# EAGLE design project_2 (EAGLE 9.6.2)
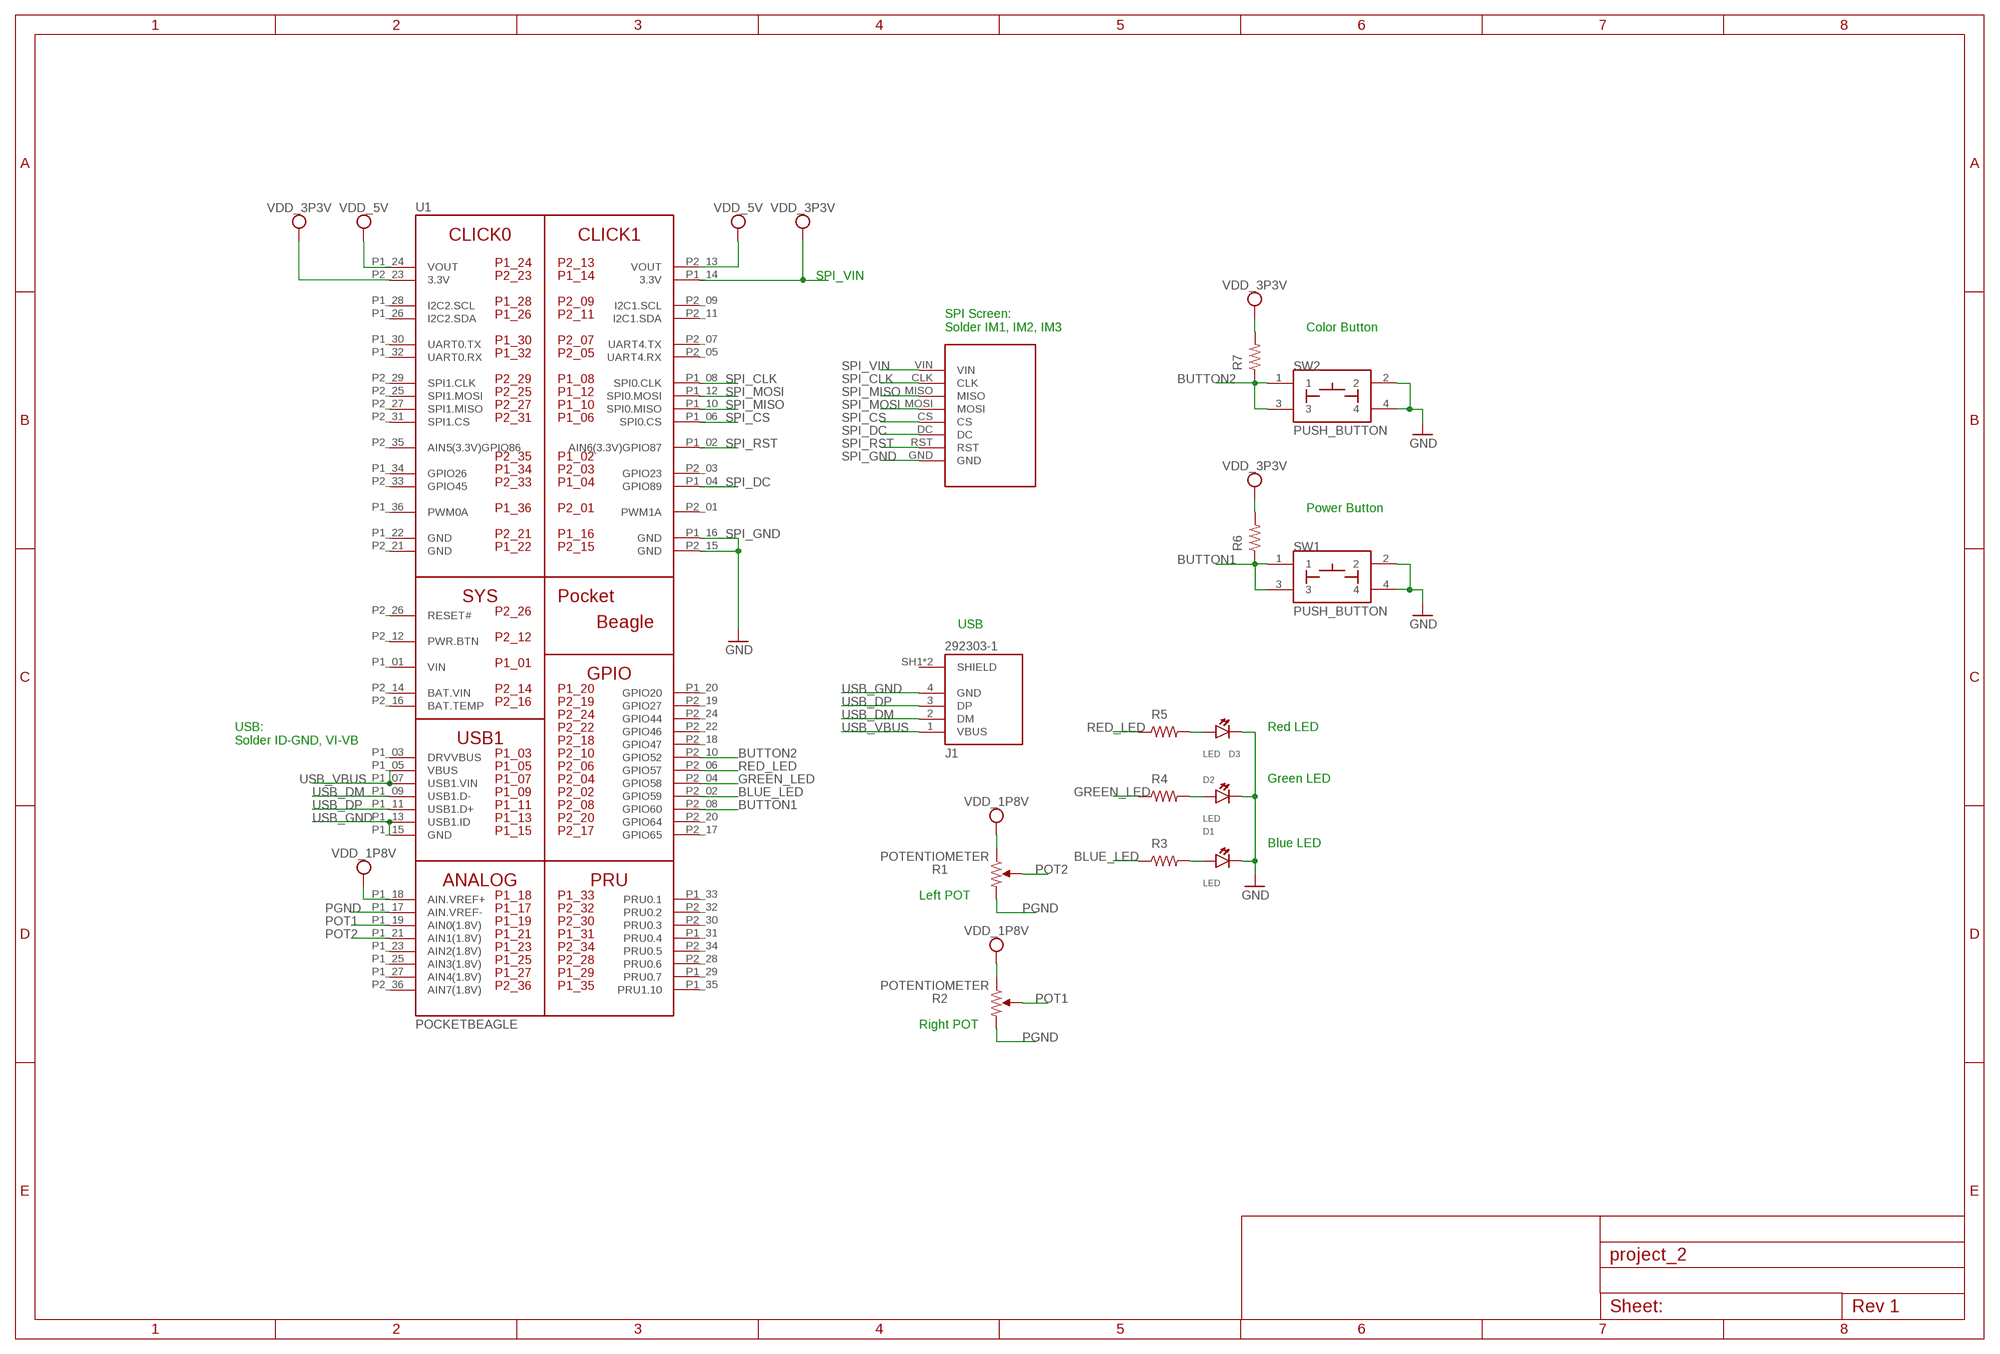
[diagram p0: schematic, sheet 1]

## Parts
D1  LED  [EIA-STD]
D2  LED  [EIA-STD]
D3  LED  [EIA-STD]
J1  292303-1  [TE_292303-1]
R1  POTENTIOMETER  [POT-PO90S]
R2  POTENTIOMETER  [POT-PO90S]
R3  R_R0805  [R0805]
R4  R_R0805  [R0805]
R5  R_R0805  [R0805]
R6  R_R0805  [R0805]
R7  R_R0805  [R0805]
SW1  PUSH_BUTTON  [BUTTON_12.5MM]
SW2  PUSH_BUTTON  [BUTTON_12.5MM]
U1  POCKETBEAGLE  [POCKETBEAGLE]
U$1  SCREEN  [SCREEN]

## Nets
BLUE_LED: R3.1 U1.P2_02(GPIO59)
BUTTON1: R6.1 SW1.1 SW1.3 U1.P2_08(GPIO60)
BUTTON2: R7.1 SW2.1 SW2.3 U1.P2_10(GPIO52)
GND: D1.CATHODE D2.CATHODE D3.CATHODE SW1.2 SW1.4 SW2.2 SW2.4
GREEN_LED: R4.1 U1.P2_04(GPIO58)
N$1: D3.ANODE R5.2
N$3: D2.ANODE R4.2
N$4: D1.ANODE R3.2
PGND: R1.CW R2.CW U1.P1_17(AIN.VREF-)
POT1: R2.S U1.P1_19(AIN0(1.8V))
POT2: R1.S U1.P1_21(AIN1(1.8V))
RED_LED: R5.1 U1.P2_06(GPIO57)
SPI_CLK: U1.P1_08(SPI0.CLK) U$1.CLK
SPI_CS: U1.P1_06(SPI0.CS) U$1.CS
SPI_DC: U1.P1_04(GPIO89) U$1.DC
SPI_GND: U1.P1_16(GND) U1.P2_15(GND) U$1.GND ; supply symbol labelled GND
SPI_MISO: U1.P1_10(SPI0.MISO) U$1.MISO
SPI_MOSI: U1.P1_12(SPI0.MOSI) U$1.MOSI
SPI_RST: U1.P1_02(AIN6(3.3V)GPIO87) U$1.RST
SPI_VIN: U$1.VIN
USB_DM: J1.2(DM) U1.P1_09(USB1.D-)
USB_DP: J1.3(DP) U1.P1_11(USB1.D+)
USB_GND: J1.4(GND) U1.P1_13(USB1.ID) U1.P1_15(GND)
USB_VBUS: J1.1(VBUS) U1.P1_05(VBUS) U1.P1_07(USB1.VIN)
VDD_1P8V: R1.CCW R2.CCW U1.P1_18(AIN.VREF+)
VDD_3P3V: R6.2 R7.2 U1.P1_14(3.3V) U1.P2_23(3.3V)
VDD_5V: U1.P1_24(VOUT) U1.P2_13(VOUT)
Unconnected: J1.SH1(SHIELD) J1.SH2(SHIELD) U1.P1_03(DRVVBUS) U1.P1_20(GPIO20) U1.P1_23(AIN2(1.8V)) U1.P1_25(AIN3(1.8V)) U1.P1_26(I2C2.SDA) U1.P1_27(AIN4(1.8V)) U1.P1_28(I2C2.SCL) U1.P1_29(PRU0.7) U1.P1_30(UART0.TX) U1.P1_31(PRU0.4) U1.P1_32(UART0.RX) U1.P1_33(PRU0.1) U1.P1_34(GPIO26) U1.P1_35(PRU1.10) U1.P1_36(PWM0A) U1.P2_01(PWM1A) U1.P2_03(GPIO23) U1.P2_05(UART4.RX) U1.P2_07(UART4.TX) U1.P2_09(I2C1.SCL) U1.P2_11(I2C1.SDA) U1.P2_12(PWR.BTN) U1.P2_16(BAT.TEMP) U1.P2_17(GPIO65) U1.P2_18(GPIO47) U1.P2_19(GPIO27) U1.P2_20(GPIO64) U1.P2_22(GPIO46) U1.P2_24(GPIO44) U1.P2_25(SPI1.MOSI) U1.P2_26(RESET#) U1.P2_27(SPI1.MISO) U1.P2_28(PRU0.6) U1.P2_29(SPI1.CLK) U1.P2_30(PRU0.3) U1.P2_31(SPI1.CS) U1.P2_32(PRU0.2) U1.P2_33(GPIO45) U1.P2_34(PRU0.5) U1.P2_35(AIN5(3.3V)GPIO86) U1.P2_36(AIN7(1.8V))

## Notes on the sheet
- SPI_VIN
- SPI Screen:
  Solder IM1, IM2, IM3
- Color Button
- Power Button
- USB
- USB:
  Solder ID-GND, VI-VB
- Red LED
- Green LED
- Blue LED
- Left POT
- Right POT

## Power pins joined to a net without a drawn wire
BAT.VIN: U1.P2_14(BAT.VIN)
GND: U1.P1_22(GND) U1.P2_21(GND)
VIN: U1.P1_01(VIN)

## Library data of the parts
D1-D3 = combo_lock:LED: EIA-STD LED, LTST-C191TBKT
J1 = combo_lock:292303-1: CONN USB RECEPT R/A TYPE A 4POS Check availability <https://pricing.snapeda.com/parts/292303-1/TE%20Connectivity/view-part?ref=eda>; AVAILABILITY: In Stock; CENTERLINE_PITCH: 2 mm[.078 in]; COMMENT: 292303-1; DESCRIPTION: Conn; Data; USB; Recept; 2.0; 4 Pos; 1 Port; Rt Angle; A Ser; Tin over Copper; EU_ROHS_COMPLIANCE: Compliant; MF: TE Connectivity; MP: 292303-1; NUMBER_OF_POSITIONS: 4; PACKAGE: None; PRICE: None; PRODUCT_TYPE: Connector; PURCHASE-URL: https://pricing.snapeda.com/search/part/292303-1/?ref=eda
R1 R2 = combo_lock:POTENTIOMETER: Potentiometer - Examples: P090S-14T20BR10K (987-1277-ND)
R3-R7 = MISC:R_: RESISTOR, American symbol
SW1 SW2 = MISC:PUSH_BUTTON
U1 = combo_lock:POCKETBEAGLE
U$1 = combo_lock:SCREEN

## Board
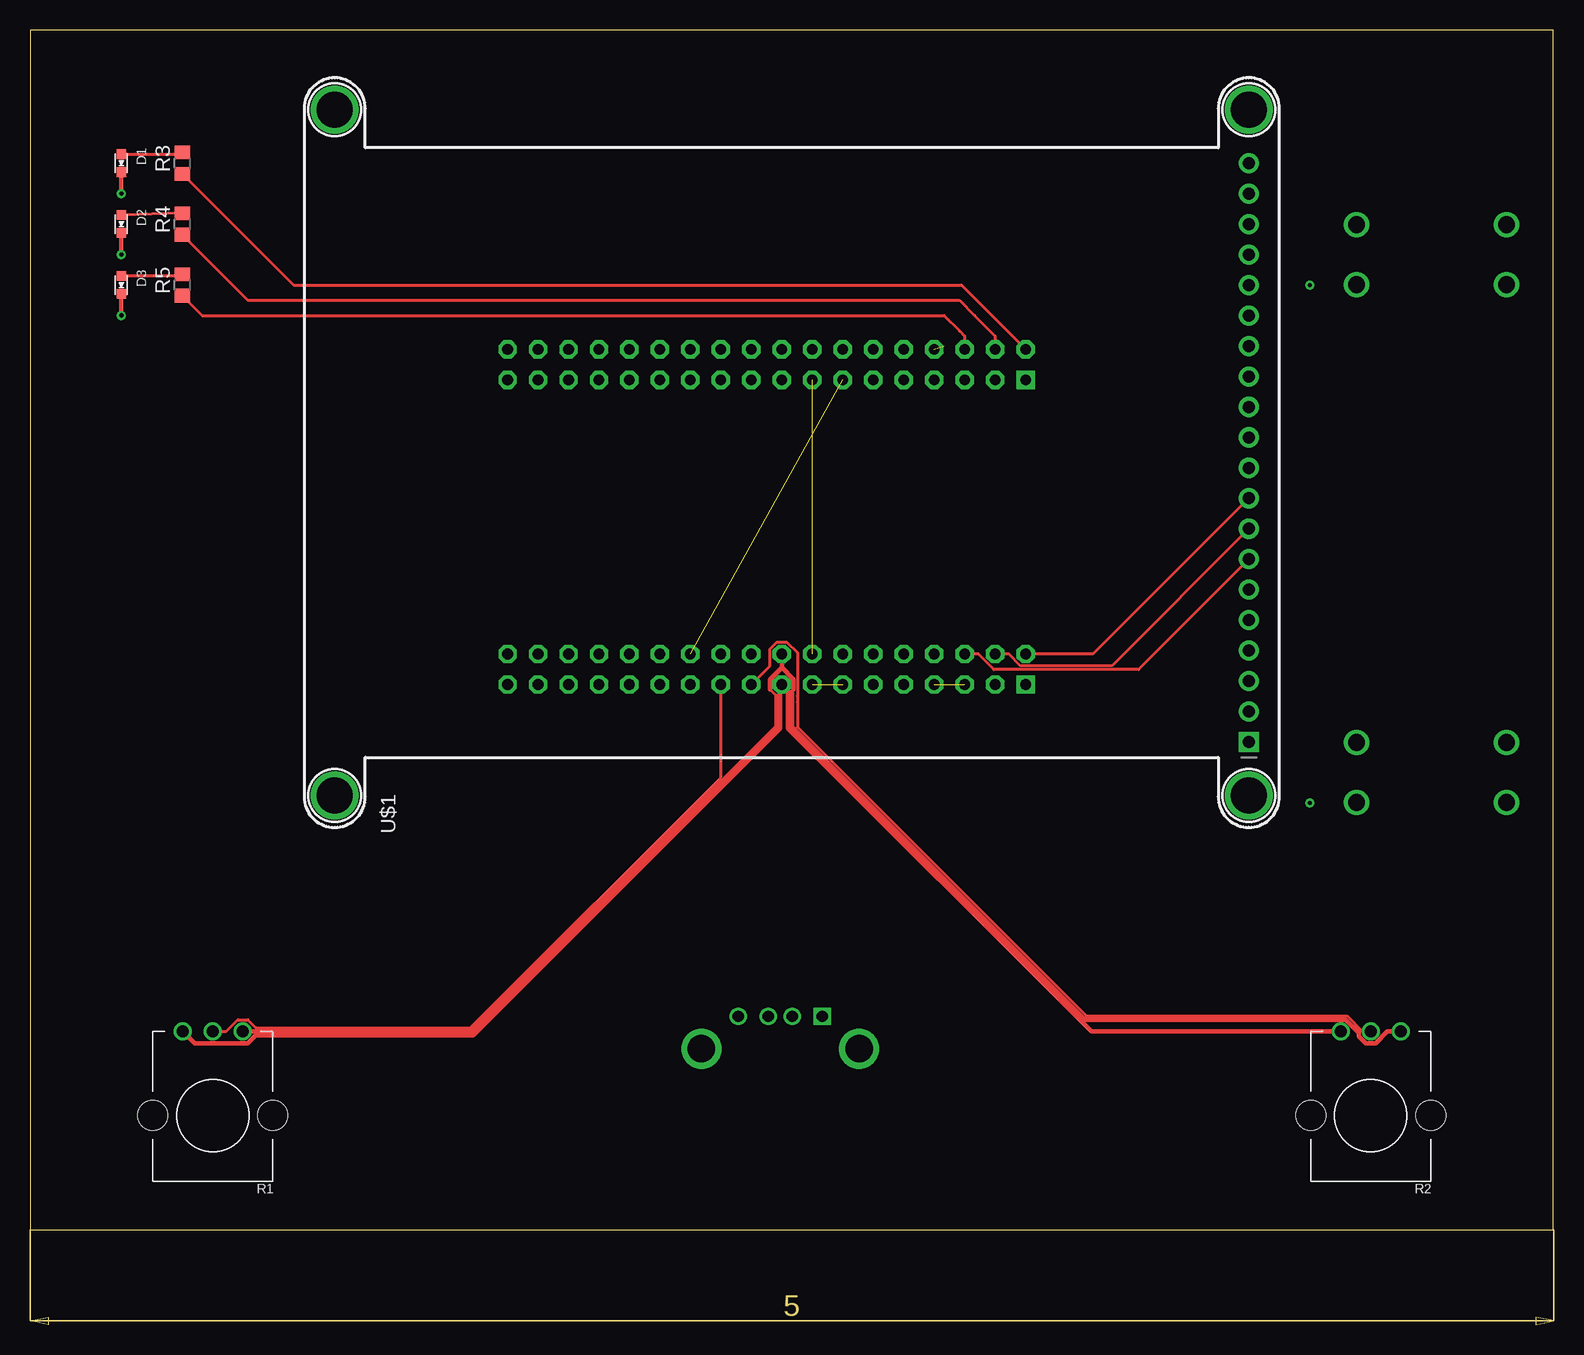
[diagram p1: board, top side]
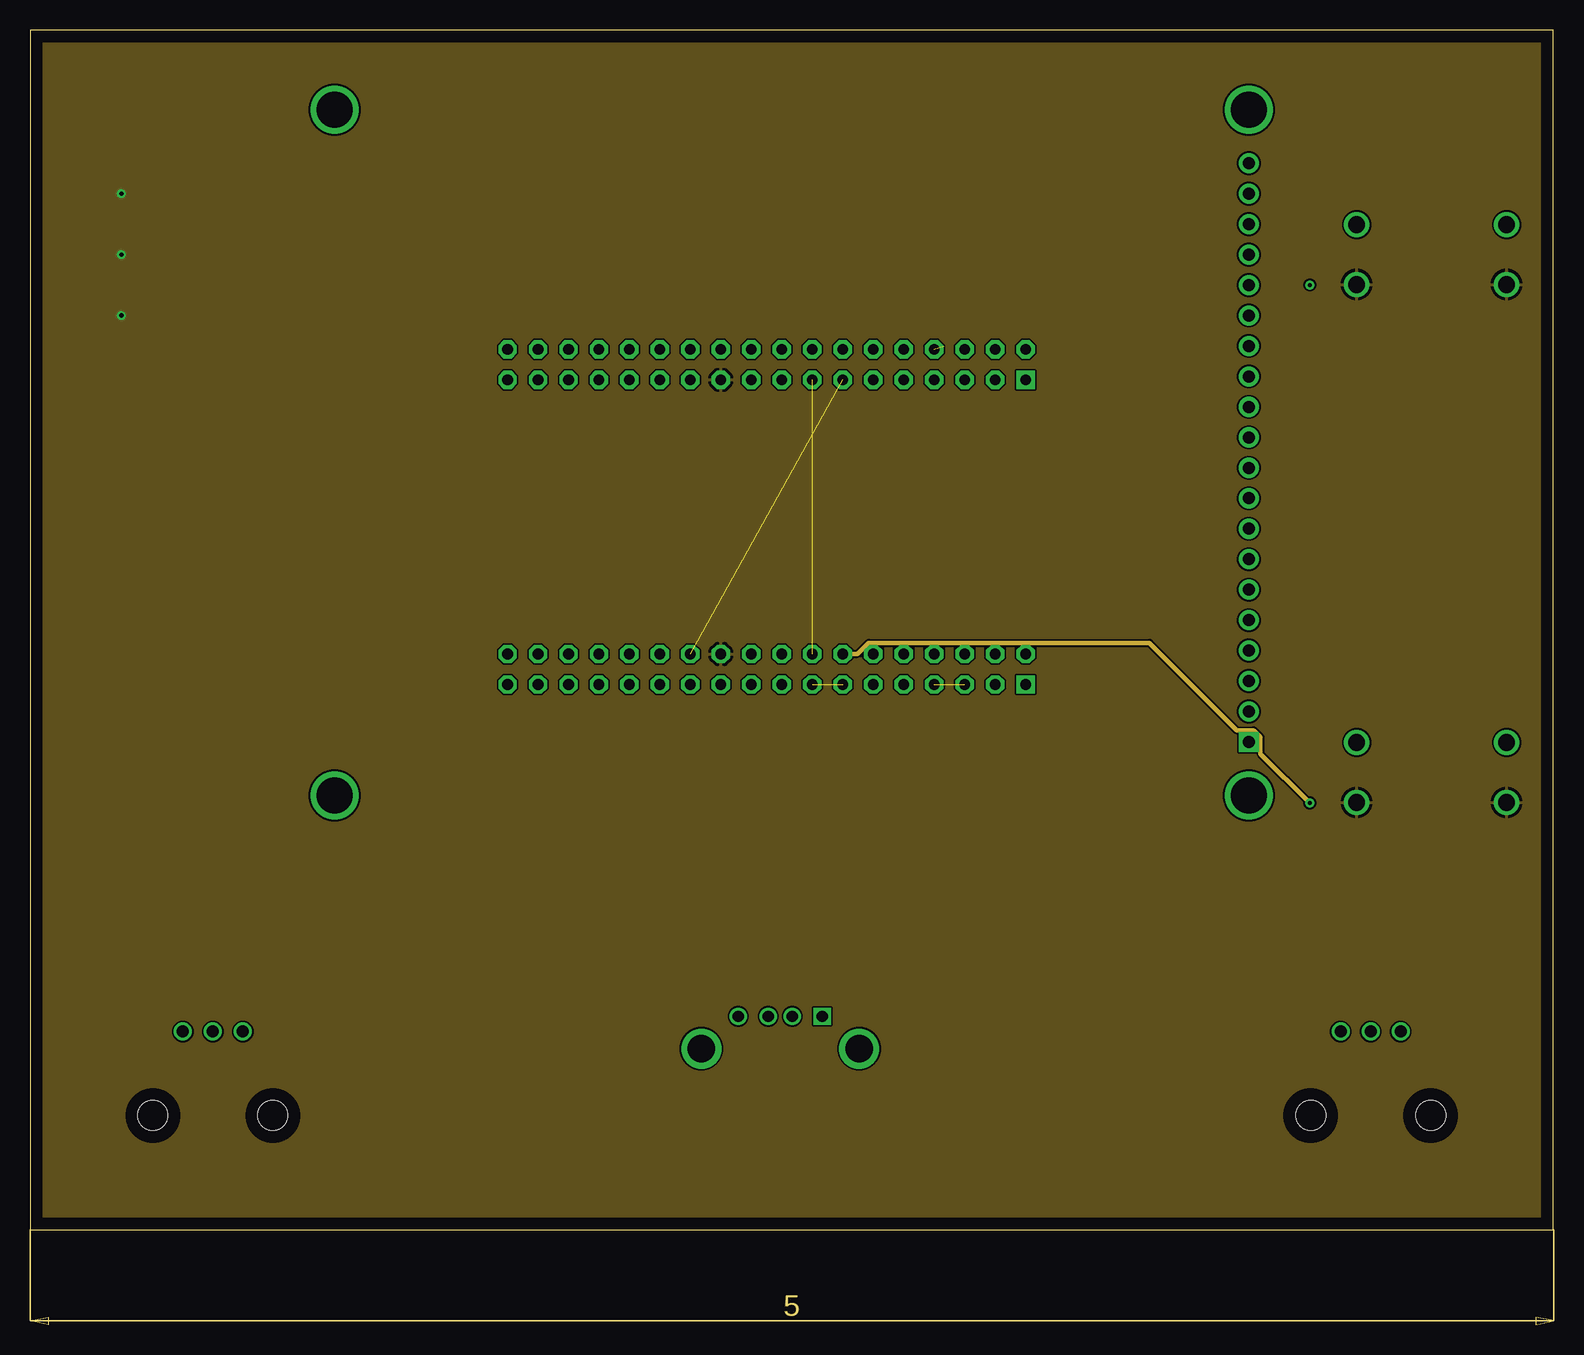
[diagram p2: board, inner layer Route2]
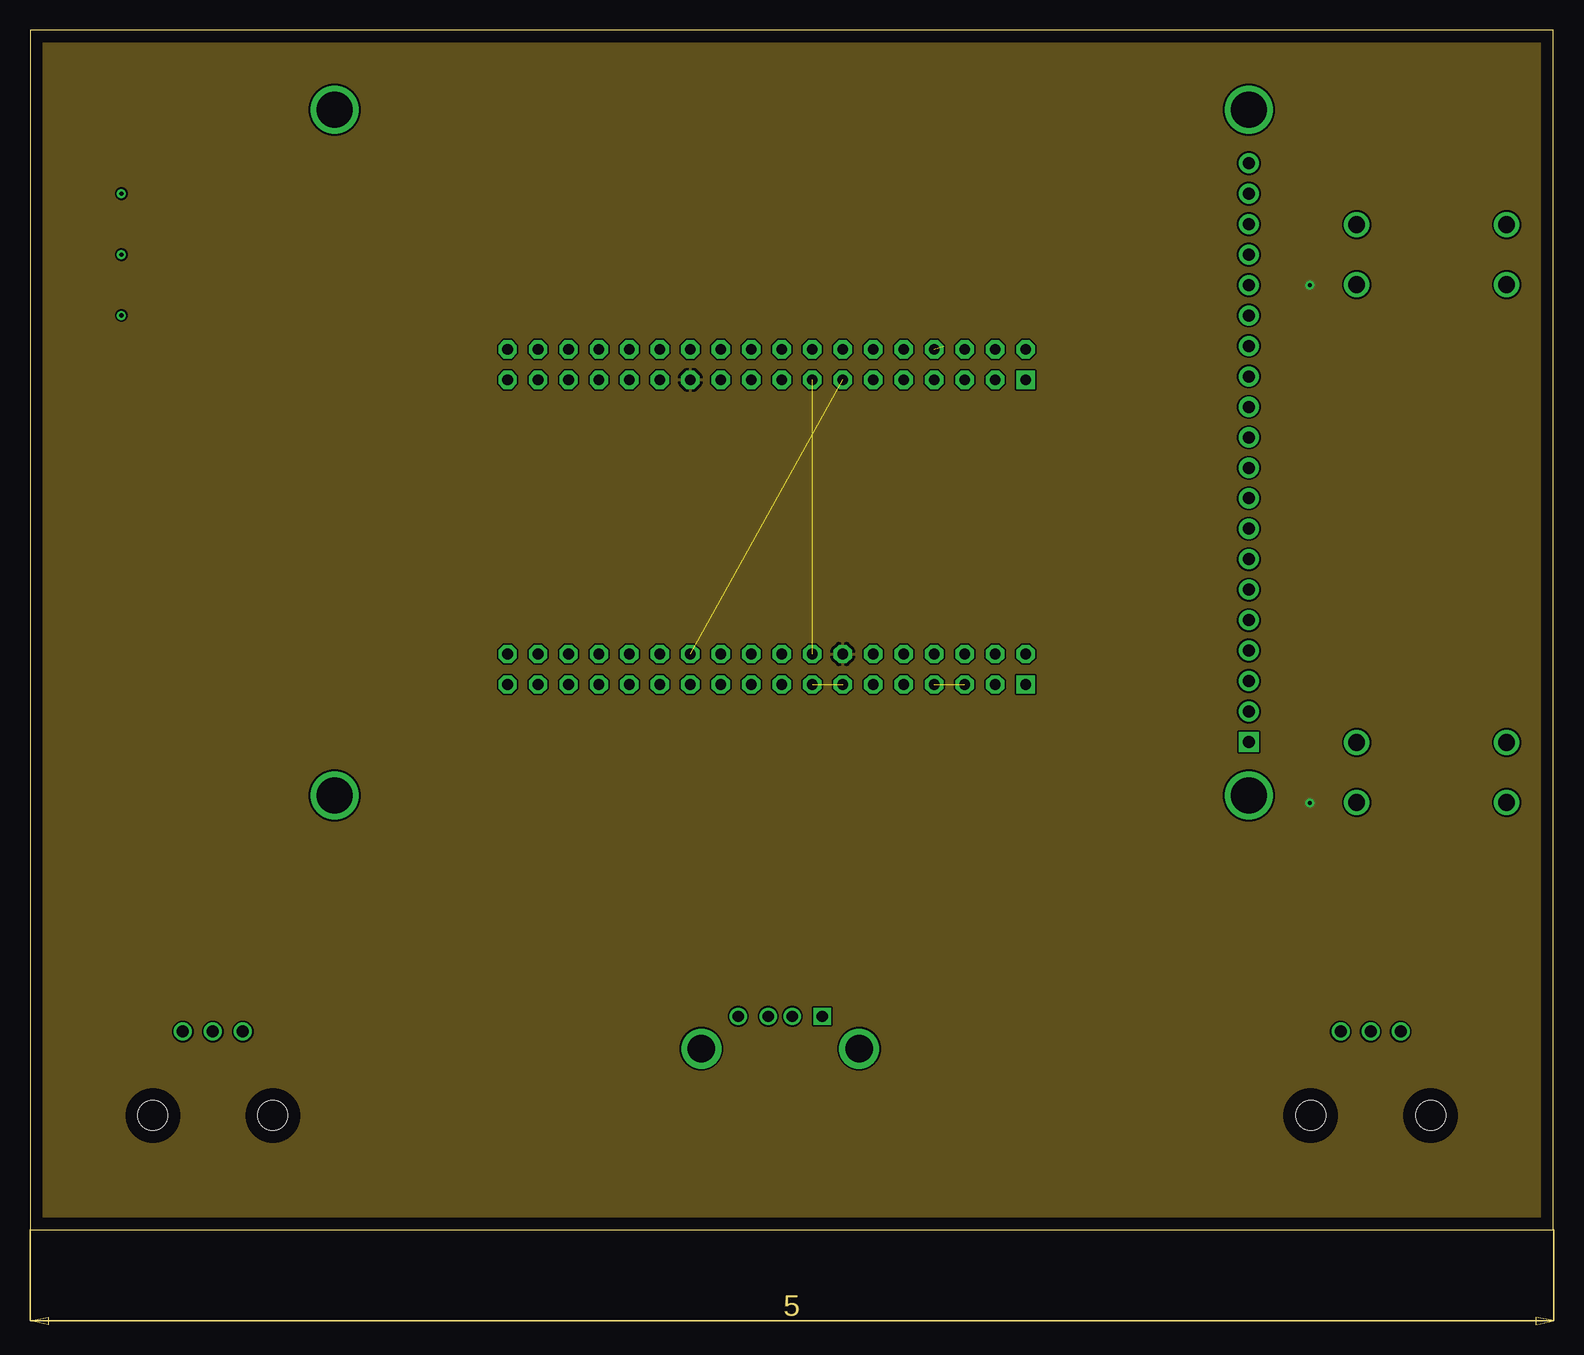
[diagram p3: board, inner layer Route15]
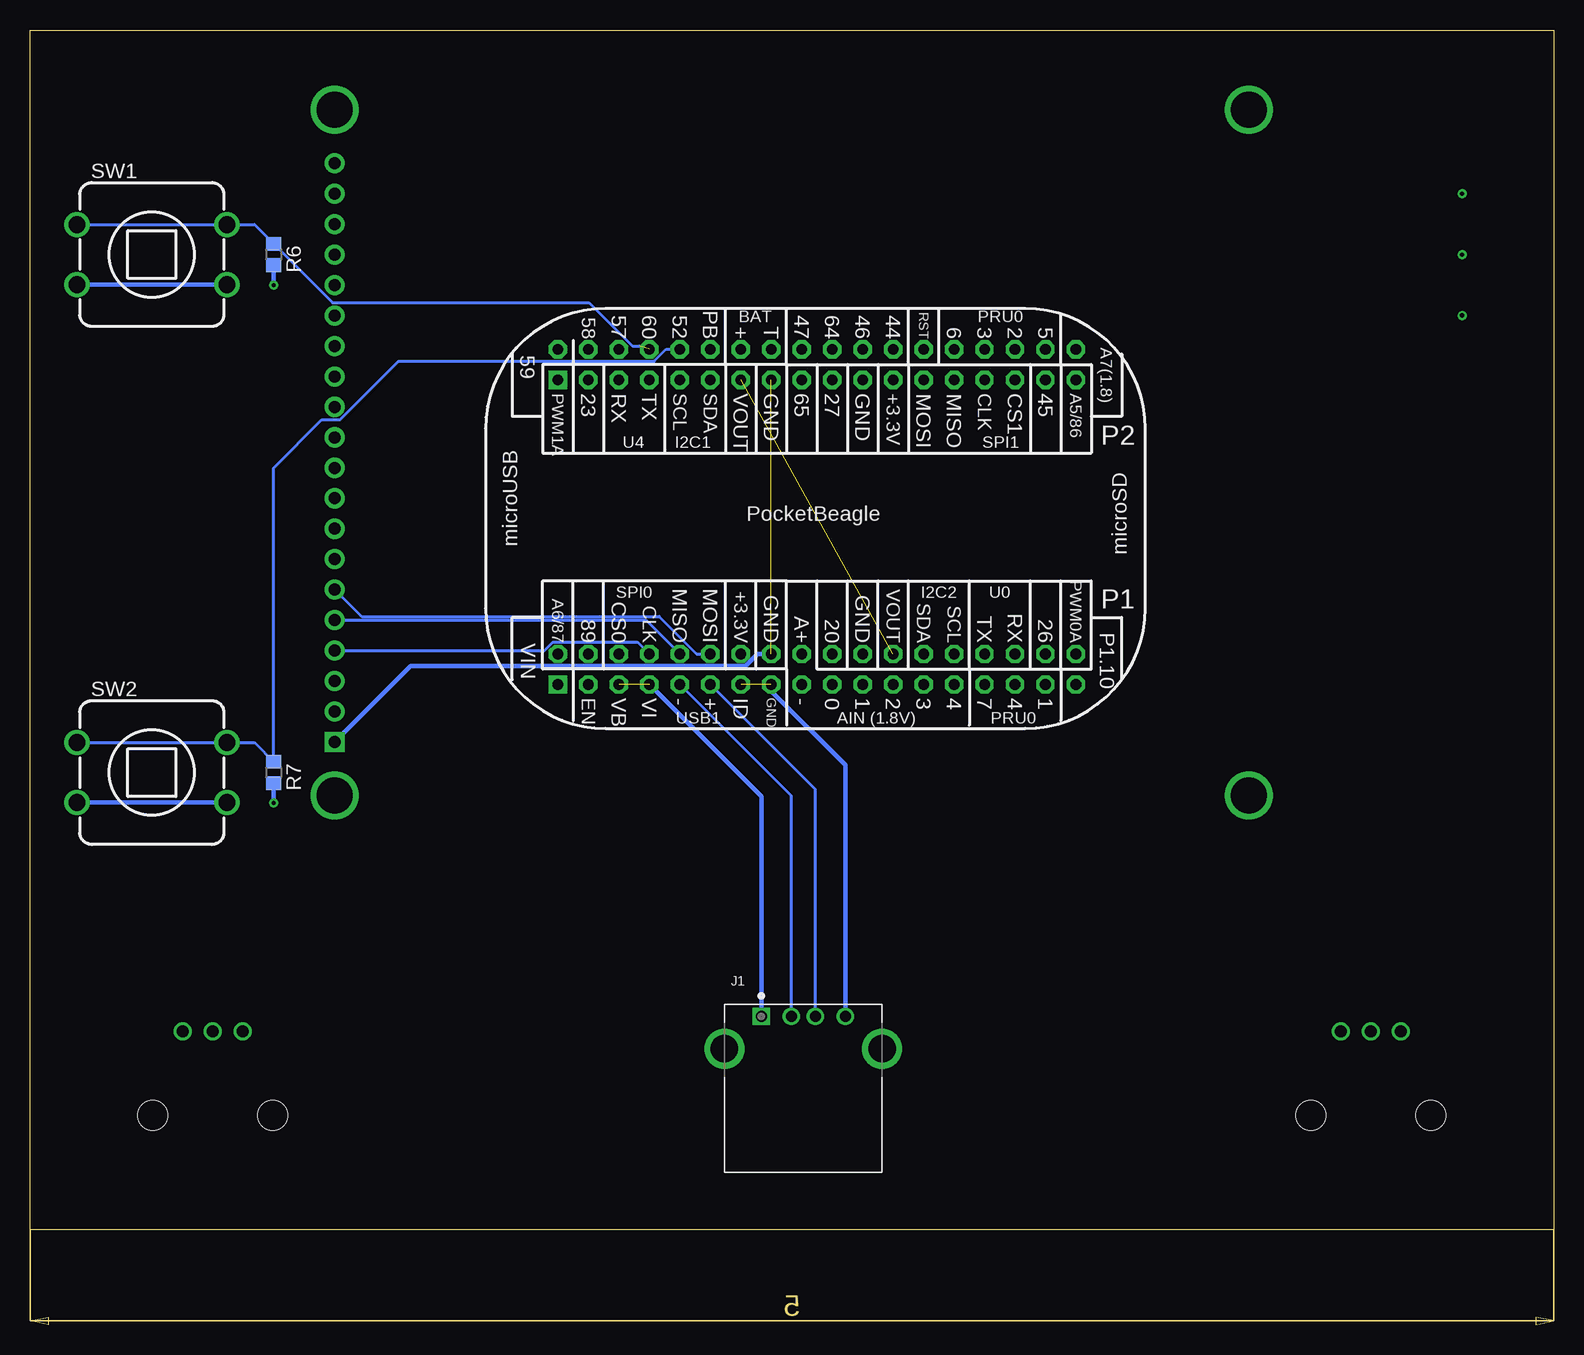
[diagram p4: board, bottom side, seen from below]

Size 126.98 x 100 mm. Coordinates in mm from the lower left corner, seen from the top.
Outline: 0,0 126.98,0 126.98,100 0,100 0,0
Copper layers (1*2*15*16): Top 0.035mm / dielectric 0.23mm / Route2 0.035mm / dielectric 0.93mm / Route15 0.035mm / dielectric 0.23mm / Bottom 0.035mm
Design rules "default *": minimum track width 10mil, minimum drill 0.35mm, track to track 6mil, track to pad 6mil, pad to pad 6mil, via to via 6mil, smd to smd 6mil, copper to edge 40mil, drill to drill 6mil, minimum pad ring 10mil, minimum via ring 8mil, stop-mask expansion 4mil, vias tented up to drill 0mil, thermal gap 10mil

### Footprints (pad centres in the part's own frame; a part is rotated, then mirrored left to right if it is on the bottom)
EIA-STD = smd 0.8 x 0.8: ANODE -0.75,0; CATHODE 0.75,0
TE_292303-1 = drill 0.92 square: 1 0,0 | drill 0.92: 2 2.5,0; 3 4.5,0; 4 7,0 | drill 2.3: SH1 -3.07,-2.71; SH2 10.07,-2.71
POT-PO90S = drill 1: CCW -2.5,0; CW 2.5,0; S 0,0 | hole 2.5: -5,7; 5,7
R0805 = smd 1.143 x 1.27: 1 -0.889,0; 2 0.889,0
BUTTON_12.5MM = drill 1.4: 1 -6.25,2.5; 2 -6.25,-2.5; 3 6.25,2.5; 4 6.25,-2.5
POCKETBEAGLE = drill 0.889 pad 1.524 square: P1_01 5.91,3.53; P2_01 5.91,28.93 | drill 0.889 pad 1.524 octagon: P1_02 5.91,6.07; P1_03 8.45,3.53; P1_04 8.45,6.07; P1_05 10.99,3.53; P1_06 10.99,6.07; P1_07 13.53,3.53; P1_08 13.53,6.07; P1_09 16.07,3.53; P1_10 16.07,6.07; P1_11 18.61,3.53; P1_12 18.61,6.07; P1_13 21.15,3.53; P1_14 21.15,6.07; P1_15 23.69,3.53; P1_16 23.69,6.07; P1_17 26.23,3.53; P1_18 26.23,6.07; P1_19 28.77,3.53; P1_20 28.77,6.07; P1_21 31.31,3.53; P1_22 31.31,6.07; P1_23 33.85,3.53; P1_24 33.85,6.07; P1_25 36.39,3.53; P1_26 36.39,6.07; P1_27 38.93,3.53; P1_28 38.93,6.07; P1_29 41.47,3.53; P1_30 41.47,6.07; P1_31 44.01,3.53; P1_32 44.01,6.07; P1_33 46.55,3.53; P1_34 46.55,6.07; P1_35 49.09,3.53; P1_36 49.09,6.07; P2_02 5.91,31.47; P2_03 8.45,28.93; P2_04 8.45,31.47; P2_05 10.99,28.93; P2_06 10.99,31.47; P2_07 13.53,28.93; P2_08 13.53,31.47; P2_09 16.07,28.93; P2_10 16.07,31.47; P2_11 18.61,28.93; P2_12 18.61,31.47; P2_13 21.15,28.93; P2_14 21.15,31.47; P2_15 23.69,28.93; P2_16 23.69,31.47; P2_17 26.23,28.93; P2_18 26.23,31.47; P2_19 28.77,28.93; P2_20 28.77,31.47; P2_21 31.31,28.93; P2_22 31.31,31.47; P2_23 33.85,28.93; P2_24 33.85,31.47; P2_25 36.39,28.93; P2_26 36.39,31.47; P2_27 38.93,28.93; P2_28 38.93,31.47; P2_29 41.47,28.93; P2_30 41.47,31.47; P2_31 44.01,28.93; P2_32 44.01,31.47; P2_33 46.55,28.93; P2_34 46.55,31.47; P2_35 49.09,28.93; P2_36 49.09,31.47
SCREEN = drill 1 pad 1.676: 3VO -19.05,-38.1; 12@JP2 3.81,-38.1; 13@JP2 6.35,-38.1; 14@JP2 8.89,-38.1; 15@JP2 11.43,-38.1; 16@JP2 13.97,-38.1; 17@JP2 16.51,-38.1; 18@JP2 19.05,-38.1; 19@JP2 21.59,-38.1; 20@JP2 24.13,-38.1; CLK -16.51,-38.1; CS -8.89,-38.1; DC -6.35,-38.1; GND@1 1.27,-38.1; LITE -1.27,-38.1; MISO -13.97,-38.1; MOSI -11.43,-38.1; RST -3.81,-38.1; VIN -21.59,-38.1 | drill 1 pad 1.676 square: GND -24.13,-38.1 | drill 3 pad 3.6: P$1@U$7 -28.575,-38.1; P$1@U$15 28.575,-38.1; P$1@U$16 -28.575,38.1; P$1@U$17 28.575,38.1

### Placement (x,y rotation side)
D1  7.62,88.9 270 top
D2  7.62,83.82 270 top
D3  7.62,78.74 270 top
J1  66.04,17.78 0 bottom
R1  15.24,16.51 180 top
R2  111.76,16.51 180 top
R3  12.7,88.9 90 top
R4  12.7,83.82 90 top
R5  12.7,78.74 90 top
R6  106.68,81.28 270 bottom
R7  106.68,38.1 270 bottom
SW1  116.84,81.28 0 bottom
SW2  116.84,38.1 0 bottom
U1  88.9,41.91 0 bottom
U$1  63.5,64.77 90 top

### Tracks (layer width: path | path; a pad name or v marks a point on that pad's centre or on a via)
BLUE_LED
  Top 0.254: R3.1 21.97,78.74 77.63,78.74 U1.P2_02
BUTTON1  (1 unrouted)
  Bottom 0.254: SW1.1 SW1.3 108.29,83.78 R6.1 101.78,77.27 80.4,77.27 76.79,73.66 76.2,73.66
BUTTON2
  Bottom 0.254: SW2.1 SW2.3 108.29,40.6 R7.1 106.68,63.5 102.67,67.51 101.16,67.51 96.28,72.39 74.96,72.39 73.97,73.38 U1.P2_10
GND  (via drill 0.35)
  Top 0.381: D1.CATHODE v7.62,86.36 | D2.CATHODE v7.62,81.28 | D3.CATHODE v7.62,76.2
  Bottom 0.381: SW2.2 SW2.4 | SW1.2 SW1.4
  pour Route2: -5.08,0 -5.08,104.14 132.08,104.14 132.08,-5.08 -5.08,-5.08
GREEN_LED
  Top 0.254: R4.1 18.16,77.47 77.47,77.47 78.74,76.2 80.45,74.49 U1.P2_04
N$1
  Top 0.254: R5.2 12.56,79.49 D3.ANODE
N$3
  Top 0.254: R4.2 D2.ANODE
N$4
  Top 0.254: D1.ANODE 12.56,89.65 R3.2
PGND
  Top 0.381: R2.CW 88.47,16.51 63.2,41.78 63.2,44.91 U1.P1_17 62.53,45.3 62.53,41.78 36.96,16.2 18.82,16.2 18.15,15.53 13.72,15.53 R1.CW
POT1
  Top 0.254: U1.P1_19 61.68,46.99 61.68,48.39 62.26,48.97 63.08,48.97 63.97,48.09 63.97,44.45 63.97,43.98 63.97,41.88 88.04,17.8 109.79,17.8 111.08,16.51 R2.S
POT2
  Top 0.254: R1.S 16.35,16.51 17.33,17.49 18.15,17.49 18.82,16.82 36.7,16.82 57.59,37.7 U1.P1_21
RED_LED
  Top 0.254: R5.1 14.35,76.2 76.2,76.2 77.47,74.93 77.91,74.49 77.91,73.66 U1.P2_06
SPI_CLK
  Bottom 0.254: U$1.CLK 84.11,48.26 83.4,48.97 76.36,48.97 U1.P1_08
SPI_CS
  Top 0.254: U1.P1_06 79.05,47.98 80.34,46.69 92.41,46.69 U$1.CS
SPI_DC
  Top 0.254: U1.P1_04 81.59,47.98 82.58,46.99 90.17,46.99 U$1.DC
SPI_GND  (1 unrouted)
  Bottom 0.381: U1.P1_16 66.35,47.98 67.34,46.99 95.25,46.99 U$1.GND
SPI_MISO
  Bottom 0.254: U$1.MISO 75.65,50.8 U1.P1_10
SPI_MOSI
  Bottom 0.254: U$1.MOSI 99.36,51.1 74.55,51.1 71.43,47.98 U1.P1_12
SPI_RST
  Top 0.254: U$1.RST 88.62,47.98 U1.P1_02
USB_DM
  Bottom 0.254: J1.2 63.54,36.15 U1.P1_09
USB_DP
  Bottom 0.254: J1.3 61.54,36.69 U1.P1_11
USB_GND  (1 unrouted)
  Bottom 0.381: J1.4 59.04,38.72 65.21,44.89 U1.P1_15
USB_VBUS  (1 unrouted)
  Bottom 0.381: J1.1 66.04,36.11 U1.P1_07
VDD_1P8V
  Top 0.254: 61.68,45.03 62.23,44.48
  Top 0.381: 61.68,45.03 61.68,45.85 62.67,46.84 | 62.23,44.48 62.23,41.91 36.83,16.51 R1.CCW | U1.P1_18 62.67,46.84 | 62.67,46.84 63.66,45.85 63.66,45.03 63.5,44.87 63.5,41.91 87.92,17.49 109.67,17.49 110.78,16.38 110.78,16.1 111.35,15.53 112.17,15.53 113.15,16.51 R2.CCW
VDD_3P3V  (via drill 0.35)
  Route2 0.381: U1.P1_14 68.98,47.98 69.91,48.91 93.33,48.91 100.62,41.62 102.01,41.62 102.58,41.05 102.58,39.66 v106.68,35.56
  Bottom 0.381: R7.2 v106.68,35.56 | R6.2 v106.68,78.74
  pour Route15: -7.62,-7.62 -7.62,106.68 134.62,106.68 134.62,-7.62
VDD_5V  (1 unrouted)

### Text on the board
silkbottom: Etch-a-Sketch REV.1 / BTM -2024